# Altium project Cell_Char_Module.PrjPcb
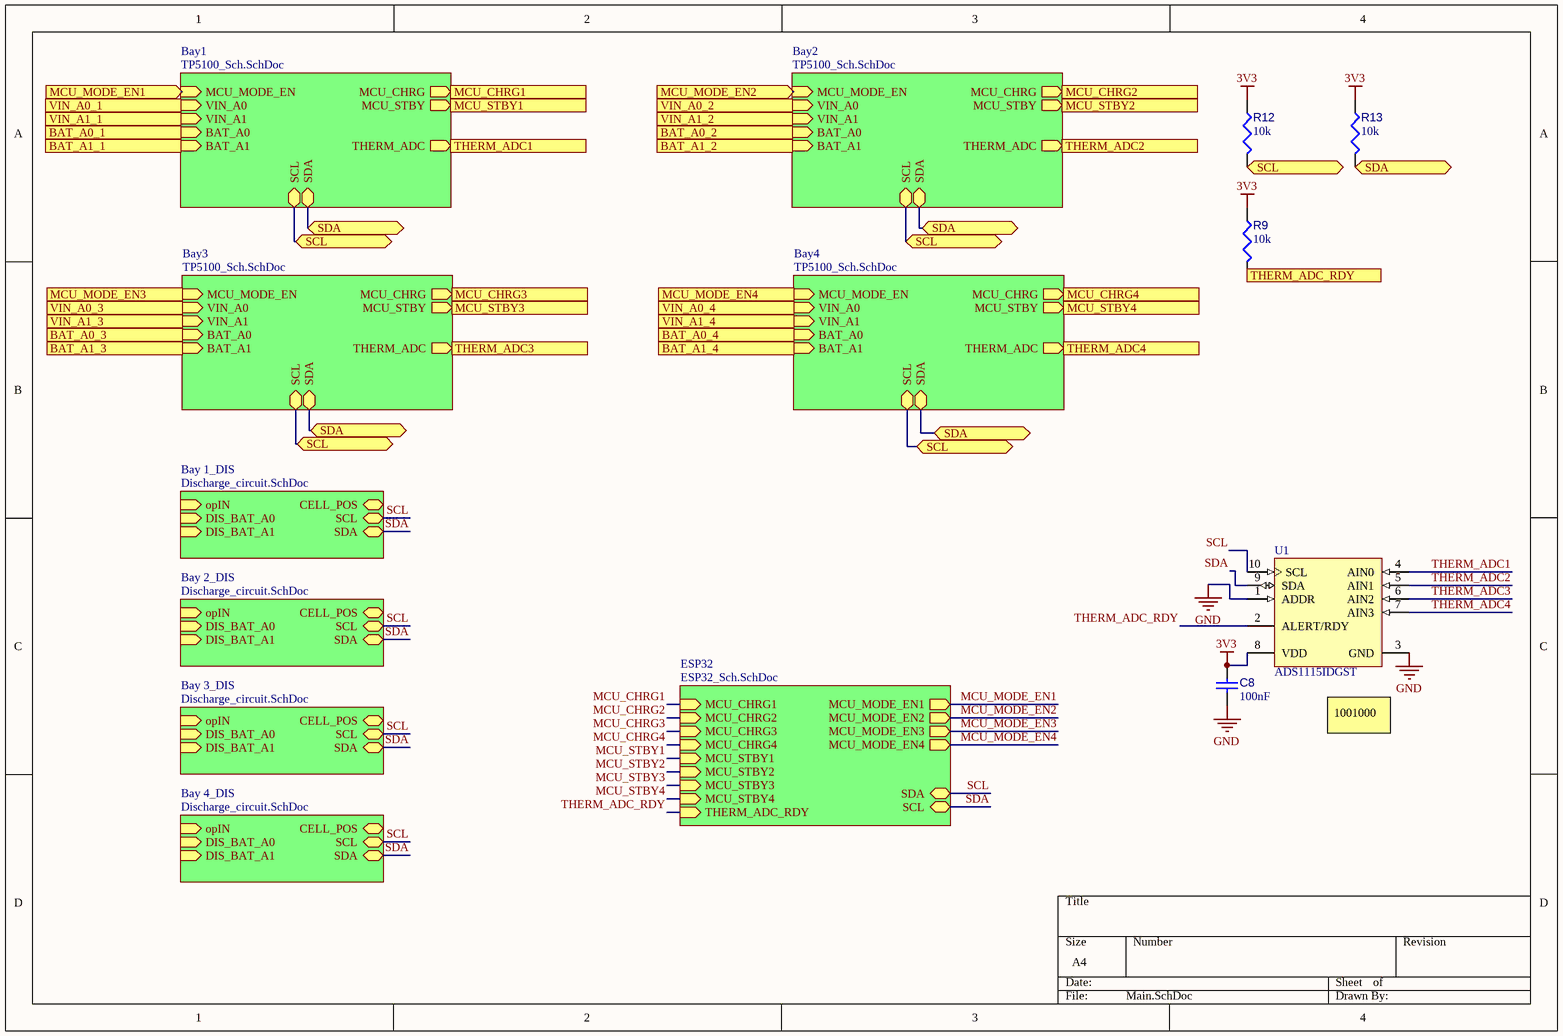
[diagram p0: Main.SchDoc]
4 sheets, 139 parts. Net scope: hierarchical (ports join the sheet entries above them; power ports are global).
Sheets:
  Main.SchDoc
    Bay1 = TP5100_Sch.SchDoc
    Bay2 = TP5100_Sch.SchDoc
    Bay3 = TP5100_Sch.SchDoc
    Bay4 = TP5100_Sch.SchDoc
    ESP32 = ESP32_Sch.SchDoc
    Bay 1_DIS = Discharge_circuit.SchDoc
    Bay 2_DIS = Discharge_circuit.SchDoc
    Bay 3_DIS = Discharge_circuit.SchDoc
    Bay 4_DIS = Discharge_circuit.SchDoc

## Sheet Main.SchDoc
size A4; SheetNumber: 2; SheetTotal: 6

### Parts
C8  value 100nF  [CAPC1005X56X25LL10T15]  (hidden comment: Capacitor 0.1 uF +/- 5% 16 V 0402)
R9  value 10k  [RESC0402(1005)_L]  (hidden comment: 10KR2F)
R12  value 10k  [RESC0402(1005)_L]  (hidden comment: 10KR2F)
R13  value 10k  [RESC0402(1005)_L]  (hidden comment: 10KR2F)
U1  ADS1115IDGST  [TI-DGS10_M]

### Sub-sheets
Bay1 = TP5100_Sch.SchDoc: MCU_MODE_EN (in), VIN_A0 (in), VIN_A1 (in), BAT_A0 (in), BAT_A1 (in), THERM_ADC (out), SCL (bidir), SDA (bidir), MCU_CHRG (out), MCU_STBY (out)
Bay2 = TP5100_Sch.SchDoc: MCU_MODE_EN (in), VIN_A0 (in), VIN_A1 (in), BAT_A0 (in), BAT_A1 (in), MCU_CHRG (out), MCU_STBY (out), THERM_ADC (out), SCL (bidir), SDA (bidir)
Bay3 = TP5100_Sch.SchDoc: MCU_MODE_EN (in), VIN_A0 (in), VIN_A1 (in), BAT_A0 (in), BAT_A1 (in), MCU_CHRG (out), MCU_STBY (out), THERM_ADC (out), SCL (bidir), SDA (bidir)
Bay4 = TP5100_Sch.SchDoc: MCU_MODE_EN (in), VIN_A0 (in), VIN_A1 (in), BAT_A0 (in), BAT_A1 (in), MCU_CHRG (out), MCU_STBY (out), THERM_ADC (out), SCL (bidir), SDA (bidir)
Bay 1_DIS = Discharge_circuit.SchDoc: opIN (in), DIS_BAT_A0 (in), DIS_BAT_A1 (in), CELL_POS (bidir), SCL (bidir), SDA (bidir)
Bay 2_DIS = Discharge_circuit.SchDoc: opIN (in), DIS_BAT_A0 (in), DIS_BAT_A1 (in), CELL_POS (bidir), SCL (bidir), SDA (bidir)
Bay 3_DIS = Discharge_circuit.SchDoc: opIN (in), DIS_BAT_A0 (in), DIS_BAT_A1 (in), CELL_POS (bidir), SCL (bidir), SDA (bidir)
Bay 4_DIS = Discharge_circuit.SchDoc: opIN (in), DIS_BAT_A0 (in), DIS_BAT_A1 (in), CELL_POS (bidir), SCL (bidir), SDA (bidir)
ESP32 = ESP32_Sch.SchDoc: MCU_MODE_EN1 (out), MCU_MODE_EN2 (out), MCU_MODE_EN3 (out), MCU_MODE_EN4 (out), MCU_CHRG1 (in), MCU_CHRG2 (in), MCU_CHRG3 (in), MCU_CHRG4 (in), MCU_STBY1 (in), MCU_STBY2 (in), MCU_STBY3 (in), MCU_STBY4 (in), THERM_ADC_RDY (in), SDA (bidir), SCL (bidir)

### Ports
BAT_A0_1 (in), BAT_A0_2 (in), BAT_A0_3 (in), BAT_A0_4 (in), BAT_A1_1 (in), BAT_A1_2 (in), BAT_A1_3 (in), BAT_A1_4 (in), MCU_CHRG1 (out), MCU_CHRG2 (out), MCU_CHRG3 (out), MCU_CHRG4 (out), MCU_MODE_EN1 (in), MCU_MODE_EN2 (in), MCU_MODE_EN3 (in), MCU_MODE_EN4 (in), MCU_STBY1 (out), MCU_STBY2 (out), MCU_STBY3 (out), MCU_STBY4 (out), SCL (bidir), SDA (bidir), THERM_ADC1 (out), THERM_ADC2 (out), THERM_ADC3 (out), THERM_ADC4 (out), THERM_ADC_RDY (out), VIN_A0_1 (in), VIN_A0_2 (in), VIN_A0_3 (in), VIN_A0_4 (in), VIN_A1_1 (in), VIN_A1_2 (in), VIN_A1_3 (in), VIN_A1_4 (in)

### Nets
3V3: C8.1 R9.1 R12.1 R13.1 U1.8(VDD)
GND: C8.2 U1.1(ADDR) U1.3(GND)
MCU_CHRG_Bay1: port MCU_CHRG1, sheet Bay1/MCU_CHRG
MCU_CHRG_Bay2: port MCU_CHRG2, sheet Bay2/MCU_CHRG
MCU_CHRG_Bay3: port MCU_CHRG3, sheet Bay3/MCU_CHRG
MCU_CHRG_Bay4: port MCU_CHRG4, sheet Bay4/MCU_CHRG
MCU_STBDY_Bay1: port MCU_STBY1, sheet Bay1/MCU_STBY
MCU_STBDY_Bay2: port MCU_STBY2, sheet Bay2/MCU_STBY
MCU_STBDY_Bay3: port MCU_STBY3, sheet Bay3/MCU_STBY
MCU_STBDY_Bay4: port MCU_STBY4, sheet Bay4/MCU_STBY
SCL: U1.10(SCL) ; sheet ESP32/SDA, sheet Bay 1_DIS/SCL, sheet Bay 2_DIS/SCL, sheet Bay 3_DIS/SCL, sheet Bay 4_DIS/SCL
SDA: U1.9(SDA) ; sheet ESP32/SCL, sheet Bay 1_DIS/SDA, sheet Bay 2_DIS/SDA, sheet Bay 3_DIS/SDA, sheet Bay 4_DIS/SDA
THERM_ADC1: U1.4(AIN0)
THERM_ADC2: U1.5(AIN1)
THERM_ADC3: U1.6(AIN2)
THERM_ADC4: U1.7(AIN3)
THERM_ADC_RDY: U1.2(ALERT/RDY) ; sheet ESP32/THERM_ADC_RDY
NetQ1_Bay1_1: port MCU_MODE_EN1, sheet Bay1/MCU_MODE_EN
NetQ1_Bay2_1: port MCU_MODE_EN2, sheet Bay2/MCU_MODE_EN
NetQ1_Bay3_1: port MCU_MODE_EN3, sheet Bay3/MCU_MODE_EN
NetQ1_Bay4_1: port MCU_MODE_EN4, sheet Bay4/MCU_MODE_EN
NetR4_Bay1_2: port THERM_ADC1, sheet Bay1/THERM_ADC
NetR4_Bay2_2: port THERM_ADC2, sheet Bay2/THERM_ADC
NetR4_Bay3_2: port THERM_ADC3, sheet Bay3/THERM_ADC
NetR4_Bay4_2: port THERM_ADC4, sheet Bay4/THERM_ADC
NetR9_2: R9.2 ; port THERM_ADC_RDY
NetR12_2: R12.2 ; port SCL, sheet Bay1/SCL, sheet Bay2/SCL, sheet Bay3/SCL, sheet Bay4/SCL
NetR13_2: R13.2 ; port SDA, sheet Bay1/SDA, sheet Bay2/SDA, sheet Bay3/SDA, sheet Bay4/SDA
NetU4_Bay1_7: port VIN_A0_1, sheet Bay1/VIN_A0
NetU4_Bay1_8: port VIN_A1_1, sheet Bay1/VIN_A1
NetU4_Bay2_7: port VIN_A0_2, sheet Bay2/VIN_A0
NetU4_Bay2_8: port VIN_A1_2, sheet Bay2/VIN_A1
NetU4_Bay3_7: port VIN_A0_3, sheet Bay3/VIN_A0
NetU4_Bay3_8: port VIN_A1_3, sheet Bay3/VIN_A1
NetU4_Bay4_7: port VIN_A0_4, sheet Bay4/VIN_A0
NetU4_Bay4_8: port VIN_A1_4, sheet Bay4/VIN_A1
NetU6_Bay1_7: port BAT_A0_1, sheet Bay1/BAT_A0
NetU6_Bay1_8: port BAT_A1_1, sheet Bay1/BAT_A1
NetU6_Bay2_7: port BAT_A0_2, sheet Bay2/BAT_A0
NetU6_Bay2_8: port BAT_A1_2, sheet Bay2/BAT_A1
NetU6_Bay3_7: port BAT_A0_3, sheet Bay3/BAT_A0
NetU6_Bay3_8: port BAT_A1_3, sheet Bay3/BAT_A1
NetU6_Bay4_7: port BAT_A0_4, sheet Bay4/BAT_A0
NetU6_Bay4_8: port BAT_A1_4, sheet Bay4/BAT_A1

### Notes on the sheet
- (near U1) 1001000

### Library data of the parts
C8 = CMP-001-00001-6: Chip Capacitor, 0.1 uF, +/- 5%, 16 V, 0402 (1005 Metric); Capacitor Type: Ceramic; Voltage Rating: 16V; Max Operating Temperature: 125°C; Min Operating Temperature: -55°C; Case/Package: 0402; Mounting Technology: SM; Pins: 2; Tolerance: 5%; RoHS Compliant: True
R9 R12 R13 = CMP-009-00066-2: 10K 0.063W 1% 0402 (1005 Metric)  SMD; Power: 63mW; Case/Package: 0402; Mounting Technology: SMT; Pins: 2; Tolerance: 1%
U1 = CMP-0003-00378-2: 16-Bit ADC with Integrated Multiplexer, PGA, Comparator, Oscillator, and Reference, -40 to 125 degC, 10-pin SOP (DGS10), Green (RoHS & no Sb/Br); Manufacturer: Texas Instruments; Sample Rate (max)(SPS): 860; SubFamily: Precision ADC (<=10MSPS); Architecture: Delta-Sigma; Digital Supply(Min)(V): 2; Resolution(Bits): 16; Digital Supply(Max)(V): 5.5; INL(Max)(+/-LSB): 1; Interface: Serial I2C; # Input Channels: 4; Eco-Plan: Green (RoHS & no Sb/Br); PackageDescription: 10-Pin Plastic Small Outline, Body 3 x 3 mm, Pitch 0.5 mm; Mounting Technology: Surface Mount; PackageReference: DGS10; DatasheetVersion: SBAS444B; ComponentLink3Description: Package Specification; ComponentLink1Description: Manufacturer URL; PartNumber: ADS1115IDGST; ComponentLink3URL: http://www.ti.com/lit/ml/mpds035b/mpds035b.pdf; ComponentLink2URL: http://www.ti.com/general/docs/lit/getliterature.tsp?genericPartNumber=ADS1115&fileType=pdf; Analog Voltage AV/DD(Min)(V): 2; ComponentLink2Description: Datasheet; PackageVersion: 4073272/C, 02/2004; Analog Voltage AV/DD(Max)(V): 5.5; Code_JEDEC: MO-153; ComponentLink1URL: http://www.ti.com/

## Sheet TP5100_Sch.SchDoc: TP5100 Layout, Cell Telemetry & ESP32 Integration
size A4; SheetNumber: 4; SheetTotal: 6
Used 4 times, as channels Bay1, Bay2, Bay3, Bay4. Parts and nets are listed once, with the designators drawn on the sheet.
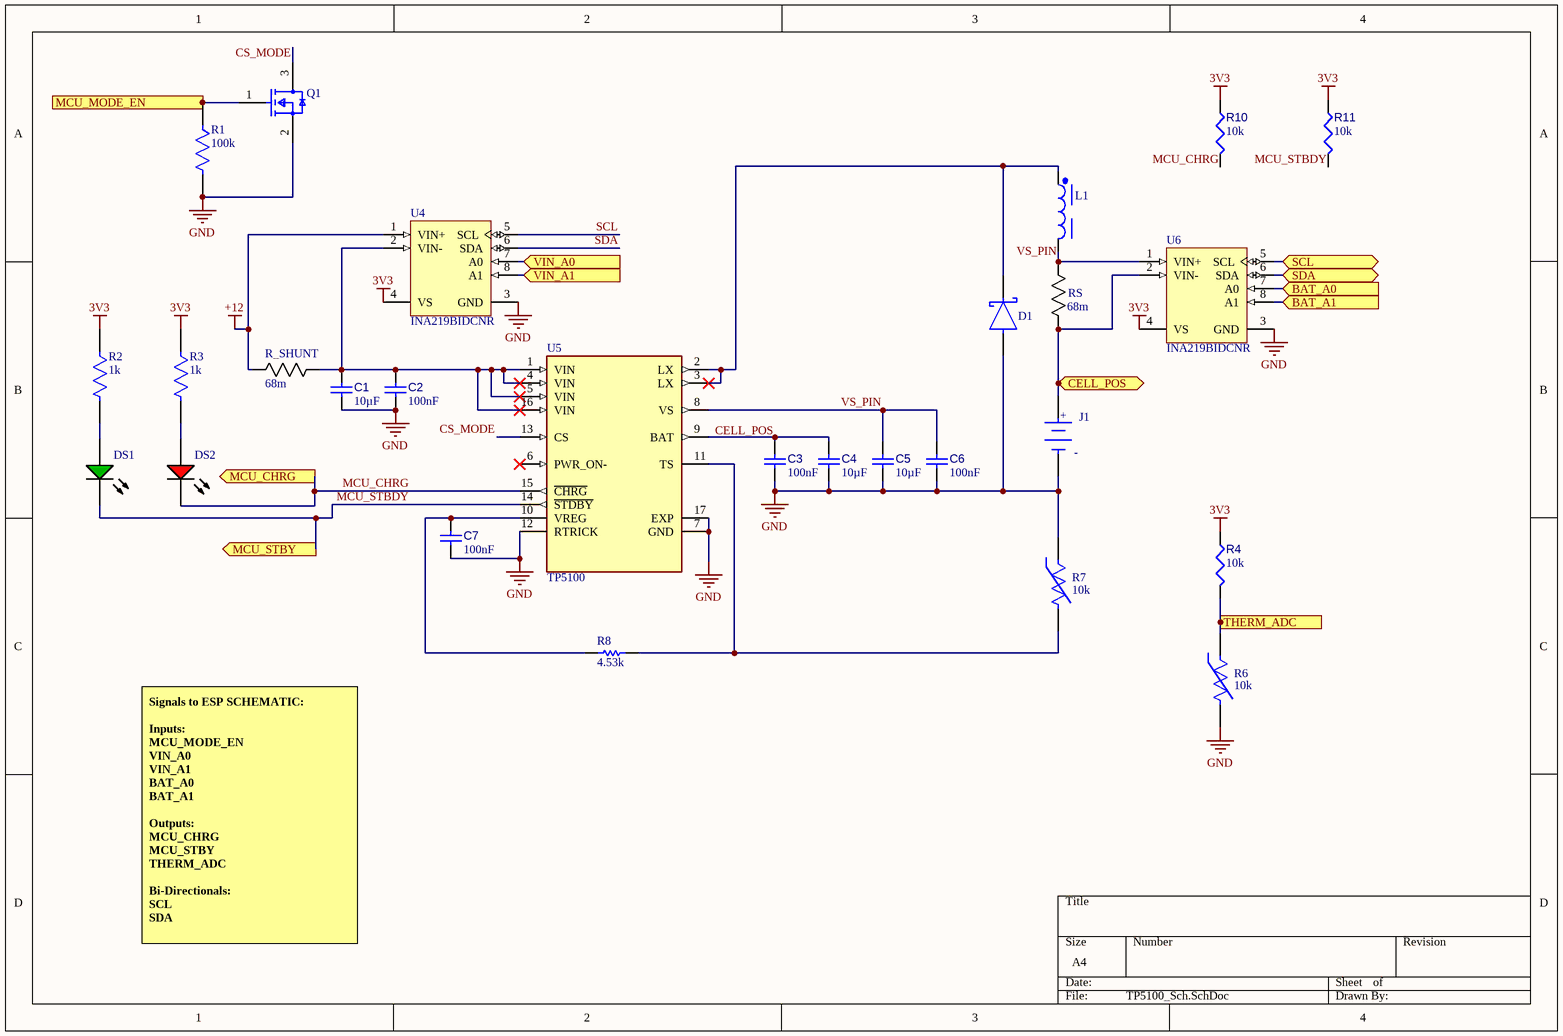
[diagram p1: TP5100_Sch.SchDoc]

### Parts
C1  value 10µF  [CAPC0402(1005)60_L]  (hidden comment: Capacitor 10µF +/-40% 6.3V 0402)
C2  value 100nF  [CAPC1005X56X25LL10T15]  (hidden comment: Capacitor 0.1 uF +/- 5% 16 V 0402)
C3  value 100nF  [CAPC1005X56X25LL10T15]  (hidden comment: Capacitor 0.1 uF +/- 5% 16 V 0402)
C4  value 10µF  [CAPC0402(1005)60_L]  (hidden comment: Capacitor 10µF +/-40% 6.3V 0402)
C5  value 10µF  [CAPC0402(1005)60_L]  (hidden comment: Capacitor 10µF +/-40% 6.3V 0402)
C6  value 100nF  [CAPC1005X56X25LL10T15]  (hidden comment: Capacitor 0.1 uF +/- 5% 16 V 0402)
C7  value 100nF  [CAPC1005X56X25LL10T15]  (hidden comment: Capacitor 0.1 uF +/- 5% 16 V 0402)
D1  SS34-E3/57T  [FP-95402-MFG]  (value not drawn)
DS1  LTL-1CHG  [LTST-LTL-1CHG-2]  (value not drawn)
DS2  WP7113SRD/D  [KING-WP7113SRDD_V]  (value not drawn)
J1  1043P  [FP-1043P-MFG]  (value not drawn)
L1  7447714220  [WE-PD_1050P]  (value not drawn)
Q1  2N7002H6327XTSA2  [FP-PG-SOT23-3-MFG]  (value not drawn)
R1  100k  [FP-RC0805-0_6-MFG]
R2  1k  [FP-RC0805-0_6-MFG]
R3  1k  [FP-RC0805-0_6-MFG]
R4  value 10k  [RESC0402(1005)_L]  (hidden comment: 10KR2F)
R6  10k  [FP-103AT-2-MFG]
R7  10k  [FP-103AT-2-MFG]
R8  4.53k  [RESC1608X55X25LL10T15]
R10  value 10k  [RESC0402(1005)_L]  (hidden comment: 10KR2F)
R11  value 10k  [RESC0402(1005)_L]  (hidden comment: 10KR2F)
R_SHUNT  68m  [YAG_R2512_YAG]
RS  68m  [YAG_R2512_YAG]
U4  INA219BIDCNR  [DCN0008A_M]
U5  TP5100  [QFN65P400X400X90-17N]
U6  INA219BIDCNR  [DCN0008A_M]

### Ports
BAT_A0 (in, see Main[1B]), BAT_A1 (in, see Main[1B]), CELL_POS (bidir), MCU_CHRG (out, see Main[2B]), MCU_MODE_EN (in, see Main[1B]), MCU_STBY (out, see Main[2B]), SCL (bidir, see Main[1B], ESP32_Sch[2B]), SDA (bidir, see Main[1B], ESP32_Sch[2B]), THERM_ADC (out, see Main[2B]), VIN_A0 (in, see Main[1B]), VIN_A1 (in, see Main[1B])

### Nets
3V3: R2.1 R3.1 R4.1 R10.1 R11.1 U4.4(VS) U6.4(VS)
+12: R_SHUNT.1 U4.1(VIN+)
GND: C1.2 C2.2 C3.2 C4.2 C5.2 C6.2 C7.2 D1.2(A) J1.1(C) Q1.2(source) R1.2 R6.2 R7.1 U4.3(GND) U5.7(GND) U5.12(RTRICK) U5.17(EXP) U6.3(GND)
BAT_A0: U6.7(A0) ; port BAT_A0
BAT_A1: U6.8(A1) ; port BAT_A1
CELL_POS: C3.1 C4.1 U5.9(BAT)
CELL_POS: J1.2(A) RS.2 U6.2(VIN-) ; port CELL_POS  [a separate net that carries the same name]
CS_MODE: Q1.3(drain) U5.13(CS)
MCU_CHRG: DS2.2(K) R10.2 U5.15(~{CHRG}) ; port MCU_CHRG
MCU_MODE_EN: Q1.1(gate) R1.1 ; port MCU_MODE_EN
MCU_STBDY: DS1.2(K) R11.2 U5.14(~{STDBY}) ; port MCU_STBY
SCL: U4.5(SCL)
SCL: U6.5(SCL) ; port SCL  [a separate net that carries the same name]
SDA: U4.6(SDA)
SDA: U6.6(SDA) ; port SDA  [a separate net that carries the same name]
THERM_ADC: R4.2 R6.1 ; port THERM_ADC
VIN_A0: U4.7(A0) ; port VIN_A0
VIN_A1: U4.8(A1) ; port VIN_A1
VS_PIN: C5.1 C6.1 L1.2 RS.1 U5.8(VS) U6.1(VIN+)
NetC1_1: C1.1 C2.1 R_SHUNT.2 U4.2(VIN-) U5.1(VIN) U5.4(VIN) U5.5(VIN) U5.16(VIN)
NetC7_1: C7.1 R8.1 U5.10(VREG)
NetD1_1: D1.1(C) L1.1 U5.2(LX) U5.3(LX)
NetDS1_1: DS1.1(A) R2.2
NetDS2_1: DS2.1(A) R3.2
NetR7_2: R7.2 R8.2 U5.11(TS)

Not connected (* = marked no-connect by the designer): U5 6(PWR_ON-)*

### Channels
Bay1: designators end in _Bay1; ports BAT_A0=NetU6_Bay1_7 BAT_A1=NetU6_Bay1_8 CELL_POS=NetJ1_Bay1_2 MCU_CHRG=MCU_CHRG_Bay1 MCU_MODE_EN=NetQ1_Bay1_1 MCU_STBY=MCU_STBDY_Bay1 SCL=NetR12_2 SDA=NetR13_2 THERM_ADC=NetR4_Bay1_2 VIN_A0=NetU4_Bay1_7 VIN_A1=NetU4_Bay1_8
Bay2: designators end in _Bay2; ports BAT_A0=NetU6_Bay2_7 BAT_A1=NetU6_Bay2_8 CELL_POS=NetJ1_Bay2_2 MCU_CHRG=MCU_CHRG_Bay2 MCU_MODE_EN=NetQ1_Bay2_1 MCU_STBY=MCU_STBDY_Bay2 SCL=NetR12_2 SDA=NetR13_2 THERM_ADC=NetR4_Bay2_2 VIN_A0=NetU4_Bay2_7 VIN_A1=NetU4_Bay2_8
Bay3: designators end in _Bay3; ports BAT_A0=NetU6_Bay3_7 BAT_A1=NetU6_Bay3_8 CELL_POS=NetJ1_Bay3_2 MCU_CHRG=MCU_CHRG_Bay3 MCU_MODE_EN=NetQ1_Bay3_1 MCU_STBY=MCU_STBDY_Bay3 SCL=NetR12_2 SDA=NetR13_2 THERM_ADC=NetR4_Bay3_2 VIN_A0=NetU4_Bay3_7 VIN_A1=NetU4_Bay3_8
Bay4: designators end in _Bay4; ports BAT_A0=NetU6_Bay4_7 BAT_A1=NetU6_Bay4_8 CELL_POS=NetJ1_Bay4_2 MCU_CHRG=MCU_CHRG_Bay4 MCU_MODE_EN=NetQ1_Bay4_1 MCU_STBY=MCU_STBDY_Bay4 SCL=NetR12_2 SDA=NetR13_2 THERM_ADC=NetR4_Bay4_2 VIN_A0=NetU4_Bay4_7 VIN_A1=NetU4_Bay4_8

### Notes on the sheet
- Signals to ESP SCHEMATIC:
  Inputs:
  MCU_MODE_EN
  VIN_A0
  VIN_A1
  BAT_A0
  BAT_A1
  Outputs:
  MCU_CHRG
  MCU_STBY
  THERM_ADC
  Bi-Directionals:
  SCL
  SDA
- (in symbol CMP-19636-000034-1) +

### Library data of the parts
C1 C4 C5 = CMP-001-00074-3: Chip Capacitor, 10µF +/-40%, 6.3V, 0402, Thickness 0.6 mm; Tolerance: 10%; Case/Package: 0402; Pins: 2; Mounting Technology: SMT; Voltage Rating: 6.3V; Max Operating Temperature: 85°C; Min Operating Temperature: -55°C
C2 C3 C6 C7 = CMP-001-00001-6: as C8 on sheet Main; Max Operating Temperature: 125°C; Min Operating Temperature: -55°C; Case/Package: 0402; Mounting Technology: SM; Pins: 2; Tolerance: 5%; RoHS Compliant: True
D1 = CMP-02539-000012-1: DIODE SCHOTTKY 40V 3A DO214AB; Manufacturer: Vishay; Max Junction Temp: +150°C; Peak Reverse Current: 0.5mA; Max Surge Forward Current: 100A; Standoff Height: 0mm; ComponentLink2Description: Datasheet; Device Class L3: Schottky Diodes; Height: 2.62mm; Max Repetitive Reverse Voltage: 40V; Lead Free: Yes; Package: 95402; Temperature Range High: +150°C; ComponentLink2URL: http://www.vishay.com/docs/88751/ss32.pdf; Temperature: -55°C to +150°C; Footprint Url: http://www.vishay.com/docs/95402/smc.pdf; Automotive: No; Forward Current: 3A; Category: Diode; Manufacturer Part Number: SS34-E3/57T; RoHS: TRUE; Device Class L2: Diodes; Mouser Description: Schottky Diodes & Rectifiers 3.0 Amp 40 Volt; Octopart: https://octopart.com/ss34-e3%2F57t-vishay-39552907; Temperature Range Low: -55°C; Device Class L1: Discrete Semiconductors; Digikey Description: DIODE SCHOTTKY 40V 3A DO214AB
DS1 = CMP-007-00019-2: LED Uni-Color Green, 100 mW, 30 mA, -55 to 100 degC, 2-Pin THD, RoHS, Bulk; Manufacturer: Lite-On; Power: 100mW; Forward Voltage: 2.6V; Forward Current: 30mA; Nominal Vf: 2.1V; Lens Style: Dome; Viewing Angle: 60degrees; Luminous Intensity: 12.6mcd; Max Operating Temperature: 100°C; Case/Package: Radial; Package Reference: LTL-1CHG; Manufacturer URL: http://www.us.liteon.com/; Package Quantity: 1000; Colour: Green; Packaging: Bulk; RoHS Compliant: True; Datasheet URL: http://datasheet.octopart.com/LTL-1CHG-Lite-On-datasheet-143841.pdf; Package Description: 2-Pin Through Hole Device, Dia 3.8 mm; Min Operating Temperature: -55°C; Mounting Technology: TH; Pins: 2; Illumination Colour: Green; Datasheet Version: Mar-00
DS2 = CMP-007-00033-2: The Super Bright Red Source Color Device, 1.85 V, -40 to 85 degC, 2-Pin THD, RoHS, Tape and Reel; Manufacturer: Kingbright; Nominal Vf: 1.85V; Luminous Intensity: 300mcd; Viewing Angle: 30degrees; Lens Style: Diffused; RoHS Compliant: True; Datasheet Version: Rev. 6A, 07/2016; Illumination Colour: Red; Case/Package: Radial; Package Reference: WP7113SRDD; Package Quantity: 500; Datasheet URL: http://www.kingbrightusa.com/images/catalog/SPEC/WP7113SRD-D.pdf; Colour: Red; Packaging: Bulk; Forward Voltage: 1.85V; Mounting Technology: TH; Package Description: 2-Pin Through Hole Device, Dia 5.9 mm, Body Length 8.6 mm
J1 = CMP-19636-000034-1: BATT HOLDER 18650 1 CELL PC PIN; Number of Cells: 1; Series: -; Termination: PC Pin; Package Quantity: 50; Min Operating Temperature: -50°C; Mount: Through Hole; Packaging: Tray; Max Operating Temperature: 145°C
L1 = CMP-1396-00034-3: Inductor Power Shielded Wirewound 22uH 20% 100KHz Ferrite 3A 0.05Ohm DCR Automotive T/R; DC Resistance (DCR): 42mΩ; Saturation Current: 3.6A; Inductance: 22µH; Self Resonant Frequency: 14.5MHz; Series Resistance: 50mΩ; Composition: Wirewound; Ambient Temperature Range High: 110°C; Test Frequency: 100kHz; Inductance Tolerance: 20%; Case/Package: Nonstandard; Shielding: Shielded; Max DC Current: 3A; Ambient Temperature Range Low: -40°C; Height: 5mm; Current Rating: 3A; Termination: SMD/SMT; Core Material: Ferrite; Number of Pins: 2; Tolerance: 20%; Min Operating Temperature: -40°C; Depth: 10mm; Height - Seated (Max): 5.0038mm; Width: 10mm; Mount: Surface Mount; Length: 10mm; RoHS: Compliant; RMS Current (Irms): 3A; REACH SVHC: Unknown; Max Operating Temperature: 150°C
Q1 = CMP-32901-000180-1: MOSFET N-CH 60V 0.3A SOT23; Rise Time: 3.3ns; Input Capacitance: 20pF; Rds On Max: 3R; Gate to Source Voltage (Vgs): 20V; Continuous Drain Current (ID): 300mA; Max Power Dissipation: 500mW; Packaging: Tape and Reel; Mount: Surface Mount; Case/Package: SOT-23; Drain to Source Voltage (Vdss): 60V; Min Operating Temperature: -55°C; Halogen Free: Halogen Free; Max Dual Supply Voltage: 60V; Number of Pins: 3; Lead Free: Lead Free; Max Operating Temperature: 150°C
R1 = CMP-03412-037835-1: RC0805JR-07100KL, RES SMD 100K OHM 5% 1/8W 0805; Voltage Rating: 150V; Power Rating: 125mW; Temperature Coefficient: 100ppm/°C; Resistance: 100kR; Radiation Hardening: No; Lead Free: Lead Free; Size Code: 0805; Resistance Tolerance: 5%; Case Code (Imperial): 0805; Min Operating Temperature: -55°C; Packaging: Tape and Reel; Termination: SMD/SMT; Number of Terminations: 2; RoHS Compliant: Yes; Features: Moisture Resistant; Construction: Rectangular; Series: RC; Max Operating Temperature: 155°C; Military Standard: Not; Depth: 1.25mm; Contact Plating: Tin; Tolerance: 5%; Max Power Dissipation: 125mW; Length: 2mm; Case Code (Metric): 2012; Resistor Type: Thick Film; Case/Package: 0805
R2 R3 = CMP-03412-037820-1: RC0805JR-071KL, RES SMD 1K OHM 5% 1/8W 0805; Voltage Rating: 150V; Resistance: 1kR; Max Power Dissipation: 125mW; Temperature Coefficient: 100ppm/°C; Size Code: 0805; Series: RC; Number of Terminations: 2; Tolerance: 5%; Features: Moisture Resistant; Termination: SMD/SMT; Min Operating Temperature: -55°C; Construction: Rectangular; Lead Free: Lead Free; Contact Plating: Tin; Radiation Hardening: No; Packaging: Tape and Reel; Length: 2mm; Resistor Type: Thick Film; Military Standard: Not; Case Code (Metric): 2012; Depth: 1.25mm; Case Code (Imperial): 0805; Power Rating: 125mW; Max Operating Temperature: 155°C; Resistance Tolerance: 5%; RoHS Compliant: Yes; Case/Package: 0805
R4 R10 R11 = CMP-009-00066-2: as R9 on sheet Main; Case/Package: 0402; Mounting Technology: SMT; Pins: 2; Tolerance: 1%
R6 R7 = CMP-2000-05824-2: 103AT-2, Thermistor NTC 10KOhm 1% 2-Pin; Resistance: 10kR; Lead Pitch: 2.54mm; Height: 2.4mm; Max Operating Temperature: 110°C; Width: 3.7mm; RoHS Compliant: Yes; Min Operating Temperature: -50°C; Termination: Radial; Packaging: Bulk; Number of Pins: 2; Series: AT; Tolerance: 1%; Length: 17mm
R8 = CMP-2000-04064-1: RC0603FR-074K53L; Manufacturer: Yageo; Part Number: RC0603FR-074K53L
R_SHUNT RS = CMP-009-00177-1: RL2512FK-070R068L; Manufacturer_Name: Yageo; Source: RL2512FK-070R068L.SchLib; Pins: 2; Design Item ID: RL2512FK-070R068L; Copyright: Copyright (C) 2026 Ultra Librarian. All rights reserved.; Manufacturer_Part_Number: RL2512FK-070R068L; Component Type: Standard
U4 U6 = CMP-0704-00043-2: Zero-Drift, Bi-Directional Current / Power Monitor, 3 to 5.5 V, -40 to 125 degC, 8-pin SOP (DCN8), Green (RoHS & no Sb/Br); Manufacturer: Texas Instruments; Gain(V/V): 1, 0.5, 0.25, 0.125; Vs(Min)(V): 3; Vs(Max)(V): 5.5; SubFamily: Current Shunt Monitor; Rating: Catalog; Small-Signal Bandwidth(Typ)(MHz): 0.011; Common Mode Range(Min)(V): 0; Quiescent Current (+/-)(Typ)(mA): 0.7; Input Offset (+/-)(Max)(uV): 50; Common Mode Range(Max)(V): 26; CMRR(Min)(dB): 100; DatasheetVersion: SBOS448F; ComponentLink2Description: Datasheet; PartNumber: INA219BIDCNR; ComponentLink3URL: http://www.ti.com/lit/ml/mpds099c/mpds099c.pdf; ComponentLink2URL: http://www.ti.com/general/docs/lit/getliterature.tsp?genericPartNumber=INA219&fileType=pdf; PackageDescription: 8-Pin Plastic Small Outline, Body 1.6 x 2.9 mm, Pitch 0.65 mm; PackageReference: DCN0008A; PackageVersion: 4202106/D, 11/2009; ComponentLink1Description: Manufacturer URL; ComponentLink3Description: Package Specification; Eco-Plan: Green (RoHS & no Sb/Br); ComponentLink1URL: http://www.ti.com/; Code_JEDEC: MO-178; Mounting Technology: Surface Mount
U5 = TP5100: 2A-switch buck 8.4V / 4.2V rechargeable lithium battery; MF: NanJing Top Power ASIC Corp.; Availability: Not in stock; MP: TP5100; Price: None; Value: *; SnapEDA_Link: https://www.snapeda.com/parts/TP5100/NanJing+Top+Power+ASIC+Corp./view-part/?ref=snap; Check_prices: https://www.snapeda.com/parts/TP5100/NanJing+Top+Power+ASIC+Corp./view-part/?ref=eda; Package: Package

## Sheet ESP32_Sch.SchDoc
size A4; SheetNumber: 4; SheetTotal: 4
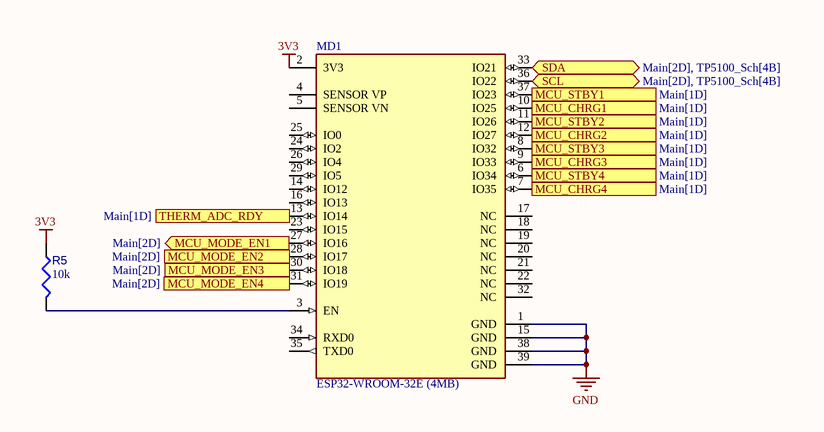
[diagram p2: ESP32_Sch.SchDoc]

### Parts
MD1  ESP32-WROOM-32E (4MB)  [FP-ESP32-WROOM-32E_4MB-MFG]
R5  value 10k  [RESC0402(1005)_L]  (hidden comment: 10KR2F)

### Ports
MCU_CHRG1 (in, see Main[1D]), MCU_CHRG2 (in, see Main[1D]), MCU_CHRG3 (in, see Main[1D]), MCU_CHRG4 (in, see Main[1D]), MCU_MODE_EN1 (out, see Main[2D]), MCU_MODE_EN2 (out, see Main[2D]), MCU_MODE_EN3 (out, see Main[2D]), MCU_MODE_EN4 (out, see Main[2D]), MCU_STBY1 (in, see Main[1D]), MCU_STBY2 (in, see Main[1D]), MCU_STBY3 (in, see Main[1D]), MCU_STBY4 (in, see Main[1D]), SCL (bidir, see Main[2D], TP5100_Sch[4B]), SDA (bidir, see Main[2D], TP5100_Sch[4B]), THERM_ADC_RDY (in, see Main[1D])

### Nets
3V3: MD1.2(3V3) R5.1
GND: MD1.1(GND) MD1.15(GND) MD1.38(GND) MD1.39(GND)
MCU_CHRG1: MD1.10(IO25) ; port MCU_CHRG1
MCU_CHRG2: MD1.12(IO27) ; port MCU_CHRG2
MCU_CHRG3: MD1.9(IO33) ; port MCU_CHRG3
MCU_CHRG4: MD1.7(IO35) ; port MCU_CHRG4
MCU_MODE_EN1: MD1.27(IO16) ; port MCU_MODE_EN1
MCU_MODE_EN2: MD1.28(IO17) ; port MCU_MODE_EN2
MCU_MODE_EN3: MD1.30(IO18) ; port MCU_MODE_EN3
MCU_MODE_EN4: MD1.31(IO19) ; port MCU_MODE_EN4
MCU_STBY1: MD1.37(IO23) ; port MCU_STBY1
MCU_STBY2: MD1.11(IO26) ; port MCU_STBY2
MCU_STBY3: MD1.8(IO32) ; port MCU_STBY3
MCU_STBY4: MD1.6(IO34) ; port MCU_STBY4
SCL: MD1.33(IO21) ; port SDA
SDA: MD1.36(IO22) ; port SCL
THERM_ADC_RDY: MD1.13(IO14) ; port THERM_ADC_RDY
NetMD1_3: MD1.3(EN) R5.2

Not connected (* = marked no-connect by the designer): MD1 4(SENSOR_VP) 5(SENSOR_VN) 14(IO12) 16(IO13) 17(NC) 18(NC) 19(NC) 20(NC) 21(NC) 22(NC) 23(IO15) 24(IO2) 25(IO0) 26(IO4) 29(IO5) 32(NC) 34(RXD0) 35(TXD0)

### Library data of the parts
MD1 = CMP-194065-000026-1: RX TXRX MOD WIFI TRACE ANT SMD
R5 = CMP-009-00066-2: as R9 on sheet Main; Case/Package: 0402; Mounting Technology: SMT; Pins: 2; Tolerance: 1%

## Sheet Discharge_circuit.SchDoc
size A4; SheetNumber: 5; SheetTotal: 6
Used 4 times, as channels Bay 1_DIS, Bay 2_DIS, Bay 3_DIS, Bay 4_DIS. Parts and nets are listed once, with the designators drawn on the sheet.
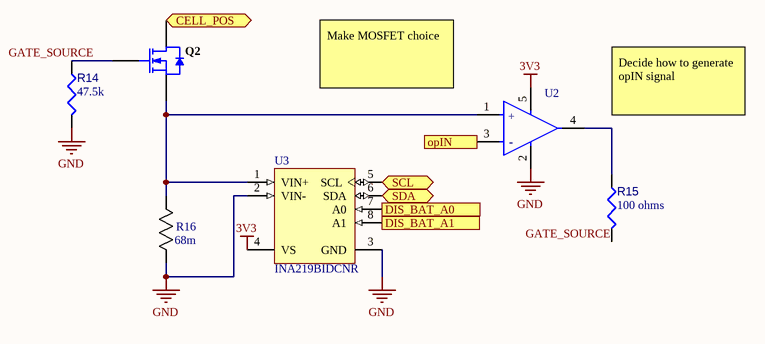
[diagram p3: Discharge_circuit.SchDoc]

### Parts
Q2  FQD13N06LTM  [FAIR-TO-252-3_V]  (value not drawn)
R14  value 47.5k  [RESC0402(1005)_L]  (hidden comment: Resistor 47K5 +/-1 % 0402 63 mW)
R15  value 100 ohms  [RESC0402(1005)_L]  (hidden comment: Resistor 100R +/-1 % 0402 63 mW)
R16  68m  [YAG_R2512_YAG]
U2  OPA391DCKT  [FP-DCK0005A-MFG]  (value not drawn)
U3  INA219BIDCNR  [DCN0008A_M]

### Ports
CELL_POS (bidir, see Main[1B]), DIS_BAT_A0 (in, see Main[1C]), DIS_BAT_A1 (in, see Main[1C]), opIN (in, see Main[1B]), SCL (bidir, see Main[1C]), SDA (bidir, see Main[1C])

### Nets
3V3: U2.5(V+) U3.4(VS)
GND: R14.2 R16.2 U2.2(V-) U3.2(VIN-) U3.3(GND)
CELL_POS: Q2.4(D) ; port CELL_POS
DIS_BAT_A0: U3.7(A0) ; port DIS_BAT_A0
DIS_BAT_A1: U3.8(A1) ; port DIS_BAT_A1
GATE_SOURCE: Q2.1(G) R14.1 R15.2
opIN: U2.3(-IN) ; port opIN
SCL: U3.5(SCL) ; port SCL
SDA: U3.6(SDA) ; port SDA
NetQ2_3: Q2.3(S) R16.1 U2.1(+IN) U3.1(VIN+)
NetR15_1: R15.1 U2.4(OUT)

### Channels
Bay 1_DIS: designators end in _Bay_1_DIS; ports CELL_POS=NetQ2_Bay_1_DIS_4 DIS_BAT_A0=NetU3_Bay_1_DIS_7 DIS_BAT_A1=NetU3_Bay_1_DIS_8 opIN=NetU2_Bay_1_DIS_3 SCL=SCL SDA=SDA
Bay 2_DIS: designators end in _Bay_2_DIS; ports CELL_POS=NetQ2_Bay_2_DIS_4 DIS_BAT_A0=NetU3_Bay_2_DIS_7 DIS_BAT_A1=NetU3_Bay_2_DIS_8 opIN=NetU2_Bay_2_DIS_3 SCL=SCL SDA=SDA
Bay 3_DIS: designators end in _Bay_3_DIS; ports CELL_POS=NetQ2_Bay_3_DIS_4 DIS_BAT_A0=NetU3_Bay_3_DIS_7 DIS_BAT_A1=NetU3_Bay_3_DIS_8 opIN=NetU2_Bay_3_DIS_3 SCL=SCL SDA=SDA
Bay 4_DIS: designators end in _Bay_4_DIS; ports CELL_POS=NetQ2_Bay_4_DIS_4 DIS_BAT_A0=NetU3_Bay_4_DIS_7 DIS_BAT_A1=NetU3_Bay_4_DIS_8 opIN=NetU2_Bay_4_DIS_3 SCL=SCL SDA=SDA

### Notes on the sheet
- Make MOSFET choice
- Decide how to generate opIN signal
- (in symbol CMP-04895-000429-1) +; -

### Library data of the parts
Q2 = CMP-013-00023-3: N-Channel QFET(R) MOSFET, 11 A, 60 V, 115 mOhm, -55 to 150 degC, 3-Pin DPAK (TO-252), RoHS, Tape and Reel; Manufacturer: Fairchild; Power: 2.5W; Elements: 1; Typical Rise Time: 90ns; Package Version: Rev. 11, 05/2016; Input Capacitance: 350pF; Packaging: TapeandReel; Package Quantity: 2500; Mounting Technology: SM; Pins: 3; Max Operating Temperature: 150°C; Package Reference: TO-252; Case/Package: TO-252-3; Datasheet Version: Rev. 1.7, 07/2016; RoHS Compliant: True; Rds On Max: 115mohm; Package Description: 3-Pin Transistor Outline, Body 6.54 x 6.095 mm, Pitch 2.28 mm; Datasheet URL: https://www.fairchildsemi.com/datasheets/FQ/FQD13N06L.pdf; Min Operating Temperature: -55°C
R14 = CMP-009-00137-3: Chip Resistor, 47,5 kOhms, +/-1 %, 63 mW, -55 to 155 degC, 0402; Power: 63mW; Tolerance: 1%; Pins: 2; Case/Package: 0402; Min Operating Temperature: -55°C; Max Operating Temperature: 155°C
R15 = CMP-009-00167-3: Chip Resistor, 100 Ohms, +/-1 %, 63 mW, -55 to 155 degC, 0402; Power: 63mW; Tolerance: 1%; Min Operating Temperature: -55°C; Case/Package: 0402; Pins: 2; Max Operating Temperature: 155°C
R16 = CMP-009-00177-1: as R_SHUNT on sheet TP5100_Sch; Source: RL2512FK-070R068L.SchLib; Pins: 2; Design Item ID: RL2512FK-070R068L; Copyright: Copyright (C) 2026 Ultra Librarian. All rights reserved.; Manufacturer_Part_Number: RL2512FK-070R068L; Component Type: Standard
U2 = CMP-04895-000429-1: IC OPAMP GP 1 CIRCUIT SC70-5
U3 = CMP-0704-00043-2: as U4 on sheet TP5100_Sch; DatasheetVersion: SBOS448F; ComponentLink2Description: Datasheet; PartNumber: INA219BIDCNR; ComponentLink3URL: http://www.ti.com/lit/ml/mpds099c/mpds099c.pdf; ComponentLink2URL: http://www.ti.com/general/docs/lit/getliterature.tsp?genericPartNumber=INA219&fileType=pdf; PackageDescription: 8-Pin Plastic Small Outline, Body 1.6 x 2.9 mm, Pitch 0.65 mm; PackageReference: DCN0008A; PackageVersion: 4202106/D, 11/2009; ComponentLink1Description: Manufacturer URL; ComponentLink3Description: Package Specification; Eco-Plan: Green (RoHS & no Sb/Br); ComponentLink1URL: http://www.ti.com/; Code_JEDEC: MO-178; Mounting Technology: Surface Mount

## Nets that join several sheets
3V3: Main (5 pins), Bay1 (7 pins), Bay2 (7 pins), Bay3 (7 pins), Bay4 (7 pins), ESP32_Sch (MD1.2 R5.1), Bay 1_DIS (U2_Bay_1_DIS.5 U3_Bay_1_DIS.4), Bay 2_DIS (U2_Bay_2_DIS.5 U3_Bay_2_DIS.4), Bay 3_DIS (U2_Bay_3_DIS.5 U3_Bay_3_DIS.4), Bay 4_DIS (U2_Bay_4_DIS.5 U3_Bay_4_DIS.4)
+12: Bay1 (R_SHUNT_Bay1.1 U4_Bay1.1), Bay2 (R_SHUNT_Bay2.1 U4_Bay2.1), Bay3 (R_SHUNT_Bay3.1 U4_Bay3.1), Bay4 (R_SHUNT_Bay4.1 U4_Bay4.1)
GND: Main (C8.2 U1.1 U1.3), Bay1 (18 pins), Bay2 (18 pins), Bay3 (18 pins), Bay4 (18 pins), ESP32_Sch (MD1.1 MD1.15 MD1.38 MD1.39), Bay 1_DIS (5 pins), Bay 2_DIS (5 pins), Bay 3_DIS (5 pins), Bay 4_DIS (5 pins)
NetR12_2: Main (R12.2), Bay1 (U6_Bay1.5), Bay2 (U6_Bay2.5), Bay3 (U6_Bay3.5), Bay4 (U6_Bay4.5)
NetR13_2: Main (R13.2), Bay1 (U6_Bay1.6), Bay2 (U6_Bay2.6), Bay3 (U6_Bay3.6), Bay4 (U6_Bay4.6)
SCL: Main (U1.10), ESP32_Sch (MD1.33), Bay 1_DIS (U3_Bay_1_DIS.5), Bay 2_DIS (U3_Bay_2_DIS.5), Bay 3_DIS (U3_Bay_3_DIS.5), Bay 4_DIS (U3_Bay_4_DIS.5)
SDA: Main (U1.9), ESP32_Sch (MD1.36), Bay 1_DIS (U3_Bay_1_DIS.6), Bay 2_DIS (U3_Bay_2_DIS.6), Bay 3_DIS (U3_Bay_3_DIS.6), Bay 4_DIS (U3_Bay_4_DIS.6)
THERM_ADC_RDY: Main (U1.2), ESP32_Sch (MD1.13)